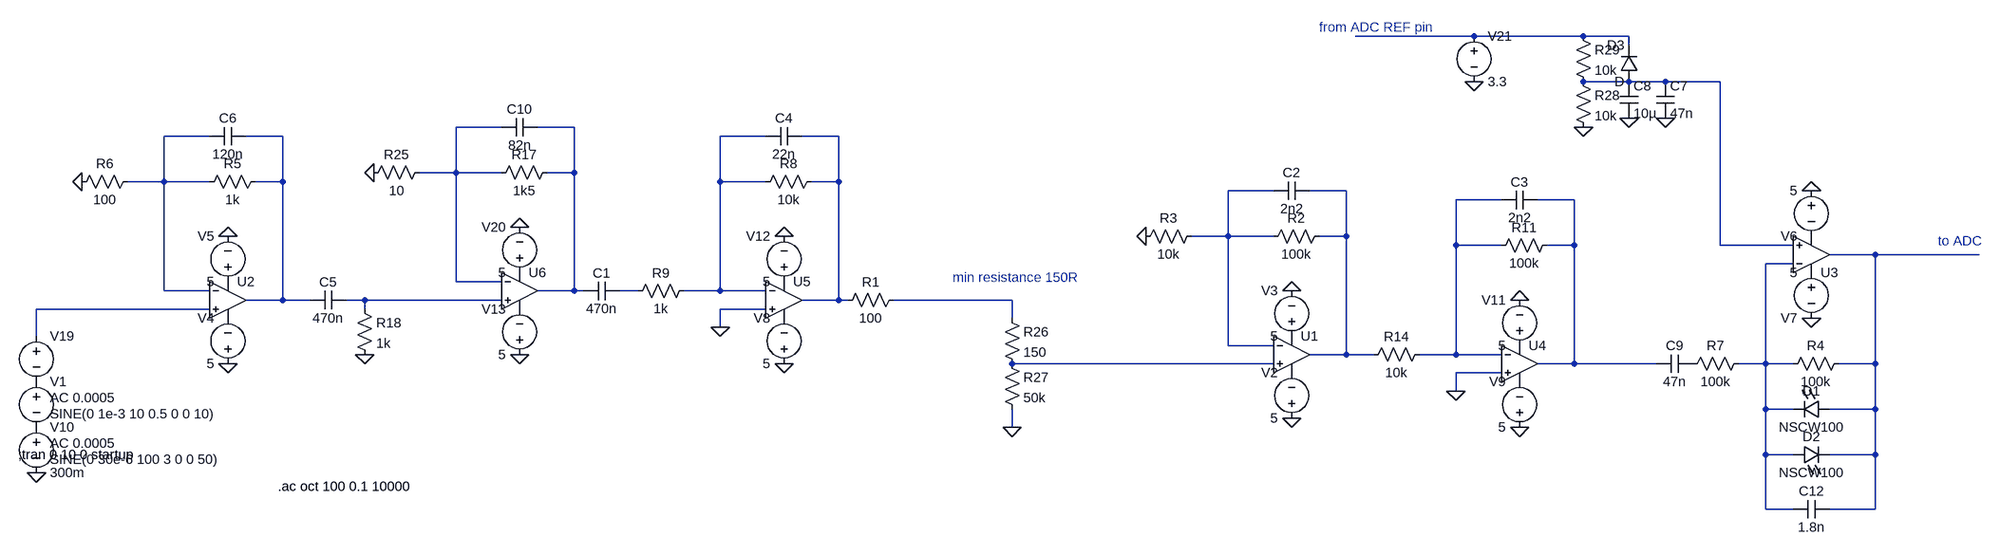
[diagram p0: schematic motion_sensor_v9.asc]
motion_sensor_v9.asc, the LTspice schematic file:
Version 4
SHEET 1 3732 1012
WIRE 1264 -896 1056 -896
WIRE 1456 -896 1264 -896
WIRE 1536 -896 1456 -896
WIRE 1536 -880 1536 -896
WIRE 1536 -816 1456 -816
WIRE 1600 -816 1536 -816
WIRE 1696 -816 1600 -816
WIRE -528 -736 -608 -736
WIRE -400 -736 -464 -736
WIRE -1040 -720 -1120 -720
WIRE -912 -720 -976 -720
WIRE -64 -720 -144 -720
WIRE 64 -720 0 -720
WIRE -608 -656 -608 -736
WIRE -608 -656 -672 -656
WIRE -528 -656 -608 -656
WIRE -400 -656 -400 -736
WIRE -400 -656 -448 -656
WIRE -1120 -640 -1120 -720
WIRE -1120 -640 -1184 -640
WIRE -1040 -640 -1120 -640
WIRE -912 -640 -912 -720
WIRE -912 -640 -960 -640
WIRE -144 -640 -144 -720
WIRE -64 -640 -144 -640
WIRE 64 -640 64 -720
WIRE 64 -640 16 -640
WIRE 912 -624 832 -624
WIRE 1040 -624 976 -624
WIRE 1312 -608 1232 -608
WIRE 1440 -608 1376 -608
WIRE 832 -544 832 -624
WIRE 832 -544 768 -544
WIRE 912 -544 832 -544
WIRE 1040 -544 1040 -624
WIRE 1040 -544 992 -544
WIRE 1232 -528 1232 -608
WIRE 1312 -528 1232 -528
WIRE 1440 -528 1440 -608
WIRE 1440 -528 1392 -528
WIRE 1696 -528 1696 -816
WIRE 1824 -528 1696 -528
WIRE 1968 -512 1888 -512
WIRE 2352 -512 1968 -512
WIRE 1824 -496 1776 -496
WIRE -608 -464 -608 -656
WIRE -528 -464 -608 -464
WIRE -1120 -448 -1120 -640
WIRE -1040 -448 -1120 -448
WIRE -400 -448 -400 -656
WIRE -400 -448 -464 -448
WIRE -384 -448 -400 -448
WIRE -288 -448 -320 -448
WIRE -144 -448 -144 -640
WIRE -144 -448 -208 -448
WIRE -64 -448 -144 -448
WIRE -912 -432 -912 -640
WIRE -912 -432 -976 -432
WIRE -864 -432 -912 -432
WIRE -768 -432 -800 -432
WIRE -528 -432 -768 -432
WIRE 64 -432 64 -640
WIRE 64 -432 0 -432
WIRE 80 -432 64 -432
WIRE 400 -432 160 -432
WIRE -1040 -416 -1344 -416
WIRE -768 -416 -768 -432
WIRE -64 -416 -144 -416
WIRE 400 -400 400 -432
WIRE -144 -384 -144 -416
WIRE -1344 -368 -1344 -416
WIRE 832 -352 832 -544
WIRE 912 -352 832 -352
WIRE 1040 -336 1040 -544
WIRE 1040 -336 976 -336
WIRE 1088 -336 1040 -336
WIRE 1232 -336 1232 -528
WIRE 1232 -336 1168 -336
WIRE 1312 -336 1232 -336
WIRE 912 -320 400 -320
WIRE 1440 -320 1440 -528
WIRE 1440 -320 1376 -320
WIRE 1584 -320 1440 -320
WIRE 1776 -320 1776 -496
WIRE 1776 -320 1728 -320
WIRE 1824 -320 1776 -320
WIRE 1968 -320 1968 -512
WIRE 1968 -320 1904 -320
WIRE 1312 -304 1232 -304
WIRE 1232 -272 1232 -304
WIRE 1776 -240 1776 -320
WIRE 1824 -240 1776 -240
WIRE 1968 -240 1968 -320
WIRE 1968 -240 1888 -240
WIRE 400 -208 400 -240
WIRE 1776 -160 1776 -240
WIRE 1824 -160 1776 -160
WIRE 1968 -160 1968 -240
WIRE 1968 -160 1888 -160
WIRE 1776 -64 1776 -160
WIRE 1824 -64 1776 -64
WIRE 1968 -64 1968 -160
WIRE 1968 -64 1888 -64
FLAG -1008 -544 0
FLAG -1008 -320 0
FLAG -1264 -640 0
FLAG -1344 -128 0
FLAG -768 -336 0
FLAG -496 -560 0
FLAG -496 -336 0
FLAG -752 -656 0
FLAG 1264 -816 0
FLAG 1456 -736 0
FLAG -32 -544 0
FLAG -32 -320 0
FLAG -144 -384 0
FLAG 944 -448 0
FLAG 944 -224 0
FLAG 688 -544 0
FLAG 1856 -400 0
FLAG 1856 -624 0
FLAG 1344 -432 0
FLAG 1344 -208 0
FLAG 1232 -272 0
FLAG 400 -208 0
FLAG 1600 -752 0
FLAG 1536 -752 0
SYMBOL voltage -1344 -304 R0
WINDOW 3 24 152 Left 2
WINDOW 123 24 124 Left 2
WINDOW 39 0 0 Left 2
SYMATTR Value SINE(0 30e-6 100 3 0 0 50)
SYMATTR Value2 AC 0.0005
SYMATTR InstName V1
SYMBOL Opamps\\UniversalOpamp2 -1008 -432 R0
SYMATTR InstName U2
SYMBOL voltage -1008 -304 R180
WINDOW 0 24 96 Left 2
WINDOW 3 24 16 Left 2
WINDOW 123 0 0 Left 2
WINDOW 39 0 0 Left 2
SYMATTR InstName V4
SYMATTR Value 5
SYMBOL voltage -1008 -448 R180
WINDOW 0 24 96 Left 2
WINDOW 3 24 16 Left 2
WINDOW 123 0 0 Left 2
WINDOW 39 0 0 Left 2
SYMATTR InstName V5
SYMATTR Value 5
SYMBOL res -944 -656 R90
WINDOW 0 0 56 VBottom 2
WINDOW 3 32 56 VTop 2
SYMATTR InstName R5
SYMATTR Value 1k
SYMBOL res -1168 -656 R90
WINDOW 0 0 56 VBottom 2
WINDOW 3 32 56 VTop 2
SYMATTR InstName R6
SYMATTR Value 100
SYMBOL cap -976 -736 R90
WINDOW 0 0 32 VBottom 2
WINDOW 3 32 32 VTop 2
SYMATTR InstName C6
SYMATTR Value 120n
SYMBOL cap -800 -448 R90
WINDOW 0 0 32 VBottom 2
WINDOW 3 32 32 VTop 2
SYMATTR InstName C5
SYMATTR Value 470n
SYMBOL voltage -1344 -224 R0
WINDOW 123 0 0 Left 2
WINDOW 39 0 0 Left 2
SYMATTR InstName V10
SYMATTR Value 300m
SYMBOL res -784 -432 R0
SYMATTR InstName R18
SYMATTR Value 1k
SYMBOL voltage -1344 -384 R0
WINDOW 3 24 152 Left 2
WINDOW 123 24 124 Left 2
WINDOW 39 0 0 Left 2
SYMATTR Value SINE(0 1e-3 10 0.5 0 0 10)
SYMATTR Value2 AC 0.0005
SYMATTR InstName V19
SYMBOL Opamps\\UniversalOpamp2 -496 -448 R0
SYMATTR InstName U6
SYMBOL voltage -496 -320 R180
WINDOW 0 24 96 Left 2
WINDOW 3 24 16 Left 2
WINDOW 123 0 0 Left 2
WINDOW 39 0 0 Left 2
SYMATTR InstName V13
SYMATTR Value 5
SYMBOL voltage -496 -464 R180
WINDOW 0 24 96 Left 2
WINDOW 3 24 16 Left 2
WINDOW 123 0 0 Left 2
WINDOW 39 0 0 Left 2
SYMATTR InstName V20
SYMATTR Value 5
SYMBOL res -432 -672 R90
WINDOW 0 0 56 VBottom 2
WINDOW 3 32 56 VTop 2
SYMATTR InstName R17
SYMATTR Value 1k5
SYMBOL res -656 -672 R90
WINDOW 0 0 56 VBottom 2
WINDOW 3 32 56 VTop 2
SYMATTR InstName R25
SYMATTR Value 10
SYMBOL cap -464 -752 R90
WINDOW 0 0 32 VBottom 2
WINDOW 3 32 32 VTop 2
SYMATTR InstName C10
SYMATTR Value 82n
SYMBOL res 384 -416 R0
SYMATTR InstName R26
SYMATTR Value 150
SYMBOL res 384 -336 R0
SYMATTR InstName R27
SYMATTR Value 50k
SYMBOL voltage 1264 -912 R0
WINDOW 123 0 0 Left 2
WINDOW 39 0 0 Left 2
SYMATTR InstName V21
SYMATTR Value 3.3
SYMBOL res 1440 -832 R0
SYMATTR InstName R28
SYMATTR Value 10k
SYMBOL res 1440 -912 R0
SYMATTR InstName R29
SYMATTR Value 10k
SYMBOL Opamps\\UniversalOpamp2 -32 -432 R0
SYMATTR InstName U5
SYMBOL voltage -32 -304 R180
WINDOW 0 24 96 Left 2
WINDOW 3 24 16 Left 2
WINDOW 123 0 0 Left 2
WINDOW 39 0 0 Left 2
SYMATTR InstName V8
SYMATTR Value 5
SYMBOL voltage -32 -448 R180
WINDOW 0 24 96 Left 2
WINDOW 3 24 16 Left 2
WINDOW 123 0 0 Left 2
WINDOW 39 0 0 Left 2
SYMATTR InstName V12
SYMATTR Value 5
SYMBOL res 32 -656 R90
WINDOW 0 0 56 VBottom 2
WINDOW 3 32 56 VTop 2
SYMATTR InstName R8
SYMATTR Value 10k
SYMBOL cap 0 -736 R90
WINDOW 0 0 32 VBottom 2
WINDOW 3 32 32 VTop 2
SYMATTR InstName C4
SYMATTR Value 22n
SYMBOL res -304 -432 R270
WINDOW 0 32 56 VTop 2
WINDOW 3 0 56 VBottom 2
SYMATTR InstName R9
SYMATTR Value 1k
SYMBOL Opamps\\UniversalOpamp2 944 -336 R0
SYMATTR InstName U1
SYMBOL voltage 944 -208 R180
WINDOW 0 24 96 Left 2
WINDOW 3 24 16 Left 2
WINDOW 123 0 0 Left 2
WINDOW 39 0 0 Left 2
SYMATTR InstName V2
SYMATTR Value 5
SYMBOL voltage 944 -352 R180
WINDOW 0 24 96 Left 2
WINDOW 3 24 16 Left 2
WINDOW 123 0 0 Left 2
WINDOW 39 0 0 Left 2
SYMATTR InstName V3
SYMATTR Value 5
SYMBOL res 1008 -560 R90
WINDOW 0 0 56 VBottom 2
WINDOW 3 32 56 VTop 2
SYMATTR InstName R2
SYMATTR Value 100k
SYMBOL res 784 -560 R90
WINDOW 0 0 56 VBottom 2
WINDOW 3 32 56 VTop 2
SYMATTR InstName R3
SYMATTR Value 10k
SYMBOL cap 976 -640 R90
WINDOW 0 0 32 VBottom 2
WINDOW 3 32 32 VTop 2
SYMATTR InstName C2
SYMATTR Value 2n2
SYMBOL Opamps\\UniversalOpamp2 1856 -512 M180
SYMATTR InstName U3
SYMBOL voltage 1856 -640 M0
WINDOW 0 24 96 Left 2
WINDOW 3 24 16 Left 2
WINDOW 123 0 0 Left 2
WINDOW 39 0 0 Left 2
SYMATTR InstName V6
SYMATTR Value 5
SYMBOL voltage 1856 -496 M0
WINDOW 0 24 96 Left 2
WINDOW 3 24 16 Left 2
WINDOW 123 0 0 Left 2
WINDOW 39 0 0 Left 2
SYMATTR InstName V7
SYMATTR Value 5
SYMBOL res 1920 -336 R90
WINDOW 0 0 56 VBottom 2
WINDOW 3 32 56 VTop 2
SYMATTR InstName R4
SYMATTR Value 100k
SYMBOL res 1744 -336 R90
WINDOW 0 0 56 VBottom 2
WINDOW 3 32 56 VTop 2
SYMATTR InstName R7
SYMATTR Value 100k
SYMBOL Opamps\\UniversalOpamp2 1344 -320 R0
SYMATTR InstName U4
SYMBOL voltage 1344 -192 R180
WINDOW 0 24 96 Left 2
WINDOW 3 24 16 Left 2
WINDOW 123 0 0 Left 2
WINDOW 39 0 0 Left 2
SYMATTR InstName V9
SYMATTR Value 5
SYMBOL voltage 1344 -336 R180
WINDOW 0 24 96 Left 2
WINDOW 3 24 16 Left 2
WINDOW 123 0 0 Left 2
WINDOW 39 0 0 Left 2
SYMATTR InstName V11
SYMATTR Value 5
SYMBOL res 1408 -544 R90
WINDOW 0 0 56 VBottom 2
WINDOW 3 32 56 VTop 2
SYMATTR InstName R11
SYMATTR Value 100k
SYMBOL cap 1376 -624 R90
WINDOW 0 0 32 VBottom 2
WINDOW 3 32 32 VTop 2
SYMATTR InstName C3
SYMATTR Value 2n2
SYMBOL res 1072 -320 R270
WINDOW 0 32 56 VTop 2
WINDOW 3 0 56 VBottom 2
SYMATTR InstName R14
SYMATTR Value 10k
SYMBOL LED 1888 -256 R90
WINDOW 0 0 32 VBottom 2
WINDOW 3 32 32 VTop 2
SYMATTR InstName D1
SYMATTR Value NSCW100
SYMATTR Description Diode
SYMATTR Type diode
SYMBOL LED 1824 -144 R270
WINDOW 0 32 32 VTop 2
WINDOW 3 0 32 VBottom 2
SYMATTR InstName D2
SYMATTR Value NSCW100
SYMATTR Description Diode
SYMATTR Type diode
SYMBOL cap 1888 -80 R90
WINDOW 0 0 32 VBottom 2
WINDOW 3 32 32 VTop 2
SYMATTR InstName C12
SYMATTR Value 1.8n
SYMBOL cap 1584 -816 R0
SYMATTR InstName C7
SYMATTR Value 47n
SYMBOL cap -320 -464 R90
WINDOW 0 0 32 VBottom 2
WINDOW 3 32 32 VTop 2
SYMATTR InstName C1
SYMATTR Value 470n
SYMBOL res 64 -416 R270
WINDOW 0 32 56 VTop 2
WINDOW 3 0 56 VBottom 2
SYMATTR InstName R1
SYMATTR Value 100
SYMBOL cap 1520 -816 R0
SYMATTR InstName C8
SYMATTR Value 10µ
SYMBOL cap 1648 -336 R90
WINDOW 0 0 32 VBottom 2
WINDOW 3 32 32 VTop 2
SYMATTR InstName C9
SYMATTR Value 47n
SYMBOL diode 1552 -816 R180
WINDOW 0 24 64 Left 2
WINDOW 3 24 0 Left 2
SYMATTR InstName D3
TEXT -1376 -160 Left 2 !;tran 0 10 0 startup
TEXT -920 -104 Left 2 !.ac oct 100 0.1 10000
TEXT 2280 -536 Left 2 ;to ADC
TEXT 992 -912 Left 2 ;from ADC REF pin
TEXT 296 -472 Left 2 ;min resistance 150R

The netlist it stands for:
* motion_sensor_v9.asc
V1 P001 P002 SINE(0 30e-6 100 3 0 0 50) AC 0.0005
XU2 N018 N005 P003 P004 N006 level.2 Avol=1Meg GBW=10Meg Slew=10Meg ilimit=25m rail=0 Vos=0 phimargin=45 en=0 enk=0 in=0 ink=0 Rin=500Meg  ; pins IN+ IN- V+ V- OUT
V4 0 P004 5
V5 P003 0 5
R5 N006 N005 1k
R6 N005 0 100
C6 N006 N005 120n
C5 N016 N006 470n
V10 P002 0 300m
R18 N016 0 1k
V19 N018 P001 SINE(0 1e-3 10 0.5 0 0 10) AC 0.0005
XU6 N016 N003 P005 P006 N004 level.2 Avol=1Meg GBW=10Meg Slew=10Meg ilimit=25m rail=0 Vos=0 phimargin=45 en=0 enk=0 in=0 ink=0 Rin=500Meg  ; pins IN+ IN- V+ V- OUT
V13 0 P006 5
V20 P005 0 5
R17 N004 N003 1k5
R25 N003 0 10
C10 N004 N003 82n
R26 N017 N019 150
R27 N019 0 50k
V21 N001 0 3.3
R28 N002 0 10k
R29 N001 N002 10k
XU5 0 N007 P007 P008 N008 level.2 Avol=1Meg GBW=10Meg Slew=10Meg ilimit=25m rail=0 Vos=0 phimargin=45 en=0 enk=0 in=0 ink=0 Rin=500Meg  ; pins IN+ IN- V+ V- OUT
V8 0 P008 5
V12 P007 0 5
R8 N008 N007 10k
C4 N008 N007 22n
R9 N015 N007 1k
XU1 N019 N009 P009 P010 N010 level.2 Avol=1Meg GBW=10Meg Slew=10Meg ilimit=25m rail=0 Vos=0 phimargin=45 en=0 enk=0 in=0 ink=0 Rin=500Meg  ; pins IN+ IN- V+ V- OUT
V2 0 P010 5
V3 P009 0 5
R2 N010 N009 100k
R3 N009 0 10k
C2 N010 N009 2n2
XU3 N002 N014 P011 P012 N013 level.2 Avol=1Meg GBW=10Meg Slew=10Meg ilimit=25m rail=0 Vos=0 phimargin=45 en=0 enk=0 in=0 ink=0 Rin=500Meg  ; pins IN+ IN- V+ V- OUT
V6 0 P012 5
V7 P011 0 5
R4 N013 N014 100k
R7 N014 P013 100k
XU4 0 N011 P014 P015 N012 level.2 Avol=1Meg GBW=10Meg Slew=10Meg ilimit=25m rail=0 Vos=0 phimargin=45 en=0 enk=0 in=0 ink=0 Rin=500Meg  ; pins IN+ IN- V+ V- OUT
V9 0 P015 5
V11 P014 0 5
R11 N012 N011 100k
C3 N012 N011 2n2
R14 N010 N011 10k
D1 N013 N014 NSCW100
D2 N014 N013 NSCW100
C12 N013 N014 1.8n
C7 N002 0 47n
C1 N015 N004 470n
R1 N008 N017 100
C8 N002 0 10µ
C9 P013 N012 47n
D3 N002 N001 D
.model D D
.lib standard.dio
;tran 0 10 0 startup
.ac oct 100 0.1 10000
* to ADC
* from ADC REF pin
* min resistance 150R
.lib UniversalOpamps2.sub
.backanno
.end